# EAGLE schematic interface (EAGLE 7.2.0)
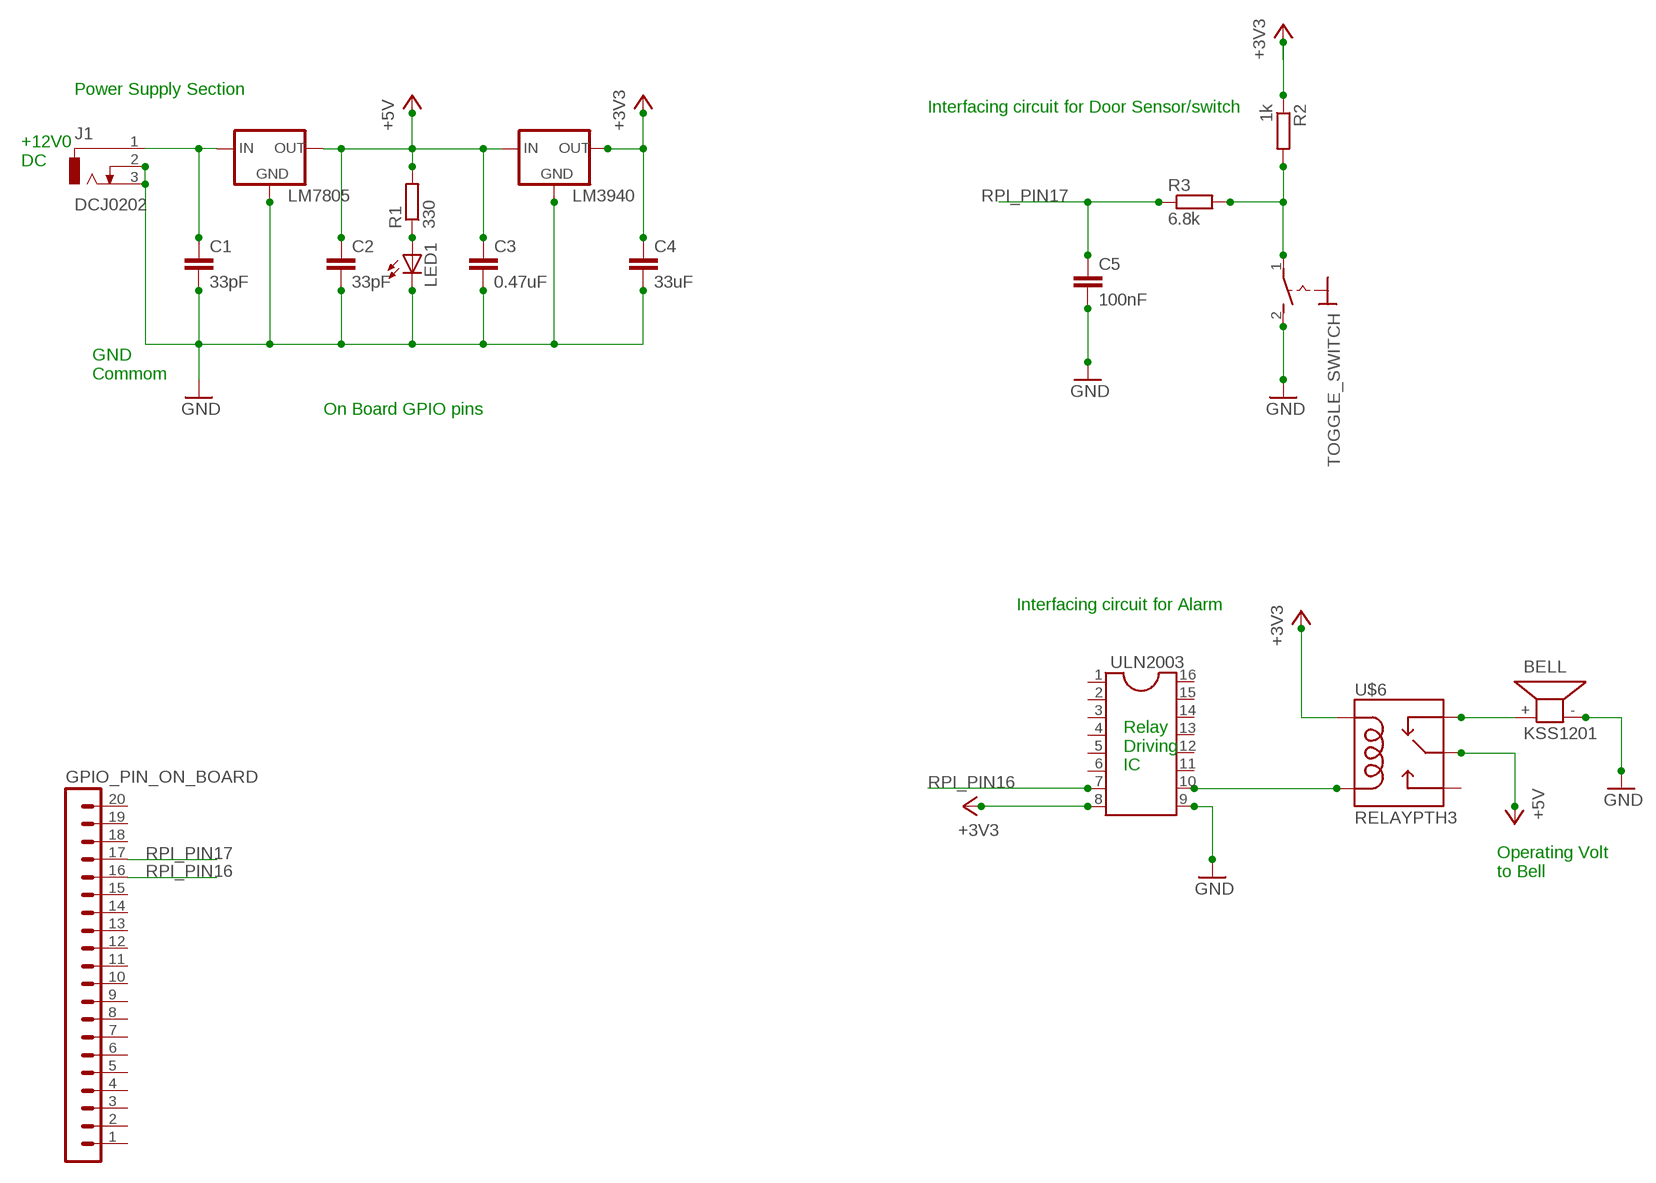
[diagram p0: schematic, sheet 1]

## Parts
BELL  KSS1201  [KSS1201]
C1  33pF  C-EU025-025X050  [C025-025X050]
C2  33pF  C-EU025-025X050  [C025-025X050]
C3  0.47uF  C-EU025-025X050  [C025-025X050]
C4  33uF  C-EU025-025X050  [C025-025X050]
C5  100nF  C-EU025-025X050  [C025-025X050]
GPIO_PIN_ON_BOARD  MA20-1  [MA20-1]
J1  DCJ0202  [DCJ0202]
LED1  LED3MM  [LED3MM]
LM3940  78XXL  [78XXL]
LM7805  78XXL  [78XXL]
R1  330  R-EU_0207/7  [0207/7]
R2  1k  R-EU_0207/7  [0207/7]
R3  6.8k  R-EU_0207/7  [0207/7]
TOGGLE_SWITCH  MS243  [MS243]
U$6  RELAYPTH3  [RELAY-T9A-2]
ULN2003  DIL16  [DIL16]

## Nets
+3V3: C4.1 LM3940.OUT R2.1 U$6.COIL1 ULN2003.8
+5V: C2.1 C3.1 LM3940.IN LM7805.OUT R1.2 U$6.MAIN
GND: BELL.- C1.2 C2.2 C3.2 C4.2 C5.2 J1.2 J1.3 LED1.K(C) LM3940.GND LM7805.GND TOGGLE_SWITCH.2(S) ULN2003.9
N$1: C1.1 J1.1 LM7805.IN
N$2: U$6.COIL2 ULN2003.10
N$3: LED1.A R1.1
N$4: R2.2 R3.2 TOGGLE_SWITCH.1(P)
N$5: BELL.+ U$6.NC
RPI_PIN16: GPIO_PIN_ON_BOARD.16 ULN2003.7
RPI_PIN17: C5.1 GPIO_PIN_ON_BOARD.17 R3.1
Unconnected: GPIO_PIN_ON_BOARD.1 GPIO_PIN_ON_BOARD.2 GPIO_PIN_ON_BOARD.3 GPIO_PIN_ON_BOARD.4 GPIO_PIN_ON_BOARD.5 GPIO_PIN_ON_BOARD.6 GPIO_PIN_ON_BOARD.7 GPIO_PIN_ON_BOARD.8 GPIO_PIN_ON_BOARD.9 GPIO_PIN_ON_BOARD.10 GPIO_PIN_ON_BOARD.11 GPIO_PIN_ON_BOARD.12 GPIO_PIN_ON_BOARD.13 GPIO_PIN_ON_BOARD.14 GPIO_PIN_ON_BOARD.15 GPIO_PIN_ON_BOARD.18 GPIO_PIN_ON_BOARD.19 GPIO_PIN_ON_BOARD.20 U$6.NO ULN2003.1 ULN2003.2 ULN2003.3 ULN2003.4 ULN2003.5 ULN2003.6 ULN2003.11 ULN2003.12 ULN2003.13 ULN2003.14 ULN2003.15 ULN2003.16

## Notes on the sheet
- Power Supply Section
- Interfacing circuit for Door Sensor/switch
- +12V0
  DC
- GND 
  Commom
- On Board GPIO pins
- Interfacing circuit for Alarm
- Relay
  Driving
  IC
- Operating Volt
  to Bell

## Library data of the parts
BELL = buzzer:KSS1201: SPEAKER Source: Schukat; OC_FARNELL: unknown; OC_NEWARK: unknown
C1-C5 = rcl:C-EU: CAPACITOR, European symbol
GPIO_PIN_ON_BOARD = con-lstb:MA20-1: PIN HEADER; OC_FARNELL: unknown; OC_NEWARK: unknown
J1 = con-jack:DCJ0202: DC POWER JACK Source: DCJ0202.pdf; OC_FARNELL: unknown; OC_NEWARK: unknown
LED1 = led:LED: LED OSRAM: - CHIPLED LG R971, LG N971, LY N971, LG Q971, LY Q971, LO R971, LY R971 LH N974, LH R974 LS Q976, LO Q976, LY Q976 LO Q996 - Hyper CHIPLED LW Q18S LB Q993, LB Q99A, LB R99A - SideLED LS A670, LO A670, LY A670, LG A670, LP A670 LB A673, LV A673, LT A673, LW A673 LH A674 LY A675 LS A676, LA A676, LO A676, LY A676, LW A676 LS A679, LY A679, LG A679 - Hyper Micro SIDELED® LS Y876, LA Y876, LO Y876, LY Y876 LT Y87S - SmartLED LW L88C, LW L88S LB L89C, LB L89S, LG L890 LS L89K, LO L89K, LY L89K LS L896, LA L896, LO L896, LY L896 - TOPLED LS T670, LO T670, LY T670, LG T670, LP T670 LSG T670, LSP T670, LSY T670, LOP T670, LYG T670 LG T671, LOG T671, LSG T671 LB T673, LV T673, LT T673, LW T673 LH T674 LS T676, LA T676, LO T676, LY T676, LB T676, LH T676, LSB T676, LW T676 LB T67C, LV T67C, LT T67C, LS T67K, LO T67K, LY T67K, LW E67C LS E67B, LA E67B, LO E67B, LY E67B, LB E67C, LV E67C, LT E67C LW T67C LS T679, LY T679, LG T679 LS T770, LO T770, LY T770, LG T770, LP T770 LB T773, LV T773, LT T773, LW T773 LH T774 LS E675, LA E675, LY E675, LS T675 LS T776, LA T776, LO T776, LY T776, LB T776 LHGB T686 LT T68C, LB T68C - Hyper Mini TOPLED® LB M676 - Mini TOPLED Santana® LG M470 LS M47K, LO M47K, LY M47K Source: http://www.osram.convergy.de LUXEON: - LUMILED® LXK2-PW12-R00, LXK2-PW12-S00, LXK2-PW14-U00, LXK2-PW14-V00 LXK2-PM12-R00, LXK2-PM12-S00, LXK2-PM14-U00 LXK2-PE12-Q00, LXK2-PE12-R00, LXK2-PE12-S00, LXK2-PE14-T00, LXK2-PE14-U00 LXK2-PB12-K00, LXK2-PB12-L00, LXK2-PB12-M00, LXK2-PB14-N00, LXK2-PB14-P00, LXK2-PB14-Q00 LXK2-PR12-L00, LXK2-PR12-M00, LXK2-PR14-Q00, LXK2-PR14-R00 LXK2-PD12-Q00, LXK2-PD12-R00, LXK2-PD12-S00 LXK2-PH12-R00, LXK2-PH12-S00 LXK2-PL12-P00, LXK2-PL12-Q00, LXK2-PL12-R00 Source: www.luxeon.com KINGBRIGHT: KA-3528ASYC Source: www.kingbright.com
LM3940 LM7805 = v-reg:78XXL: VOLTAGE REGULATOR
R1-R3 = rcl:R-EU_: RESISTOR, European symbol
TOGGLE_SWITCH = switch:MS243: TOGGLE SWITCH
U$6 = SparkFun:RELAY
ULN2003 = ic-package:DIL16: Dual In Line / Socket